# EAGLE design Nixie_PSU (EAGLE 6.1)
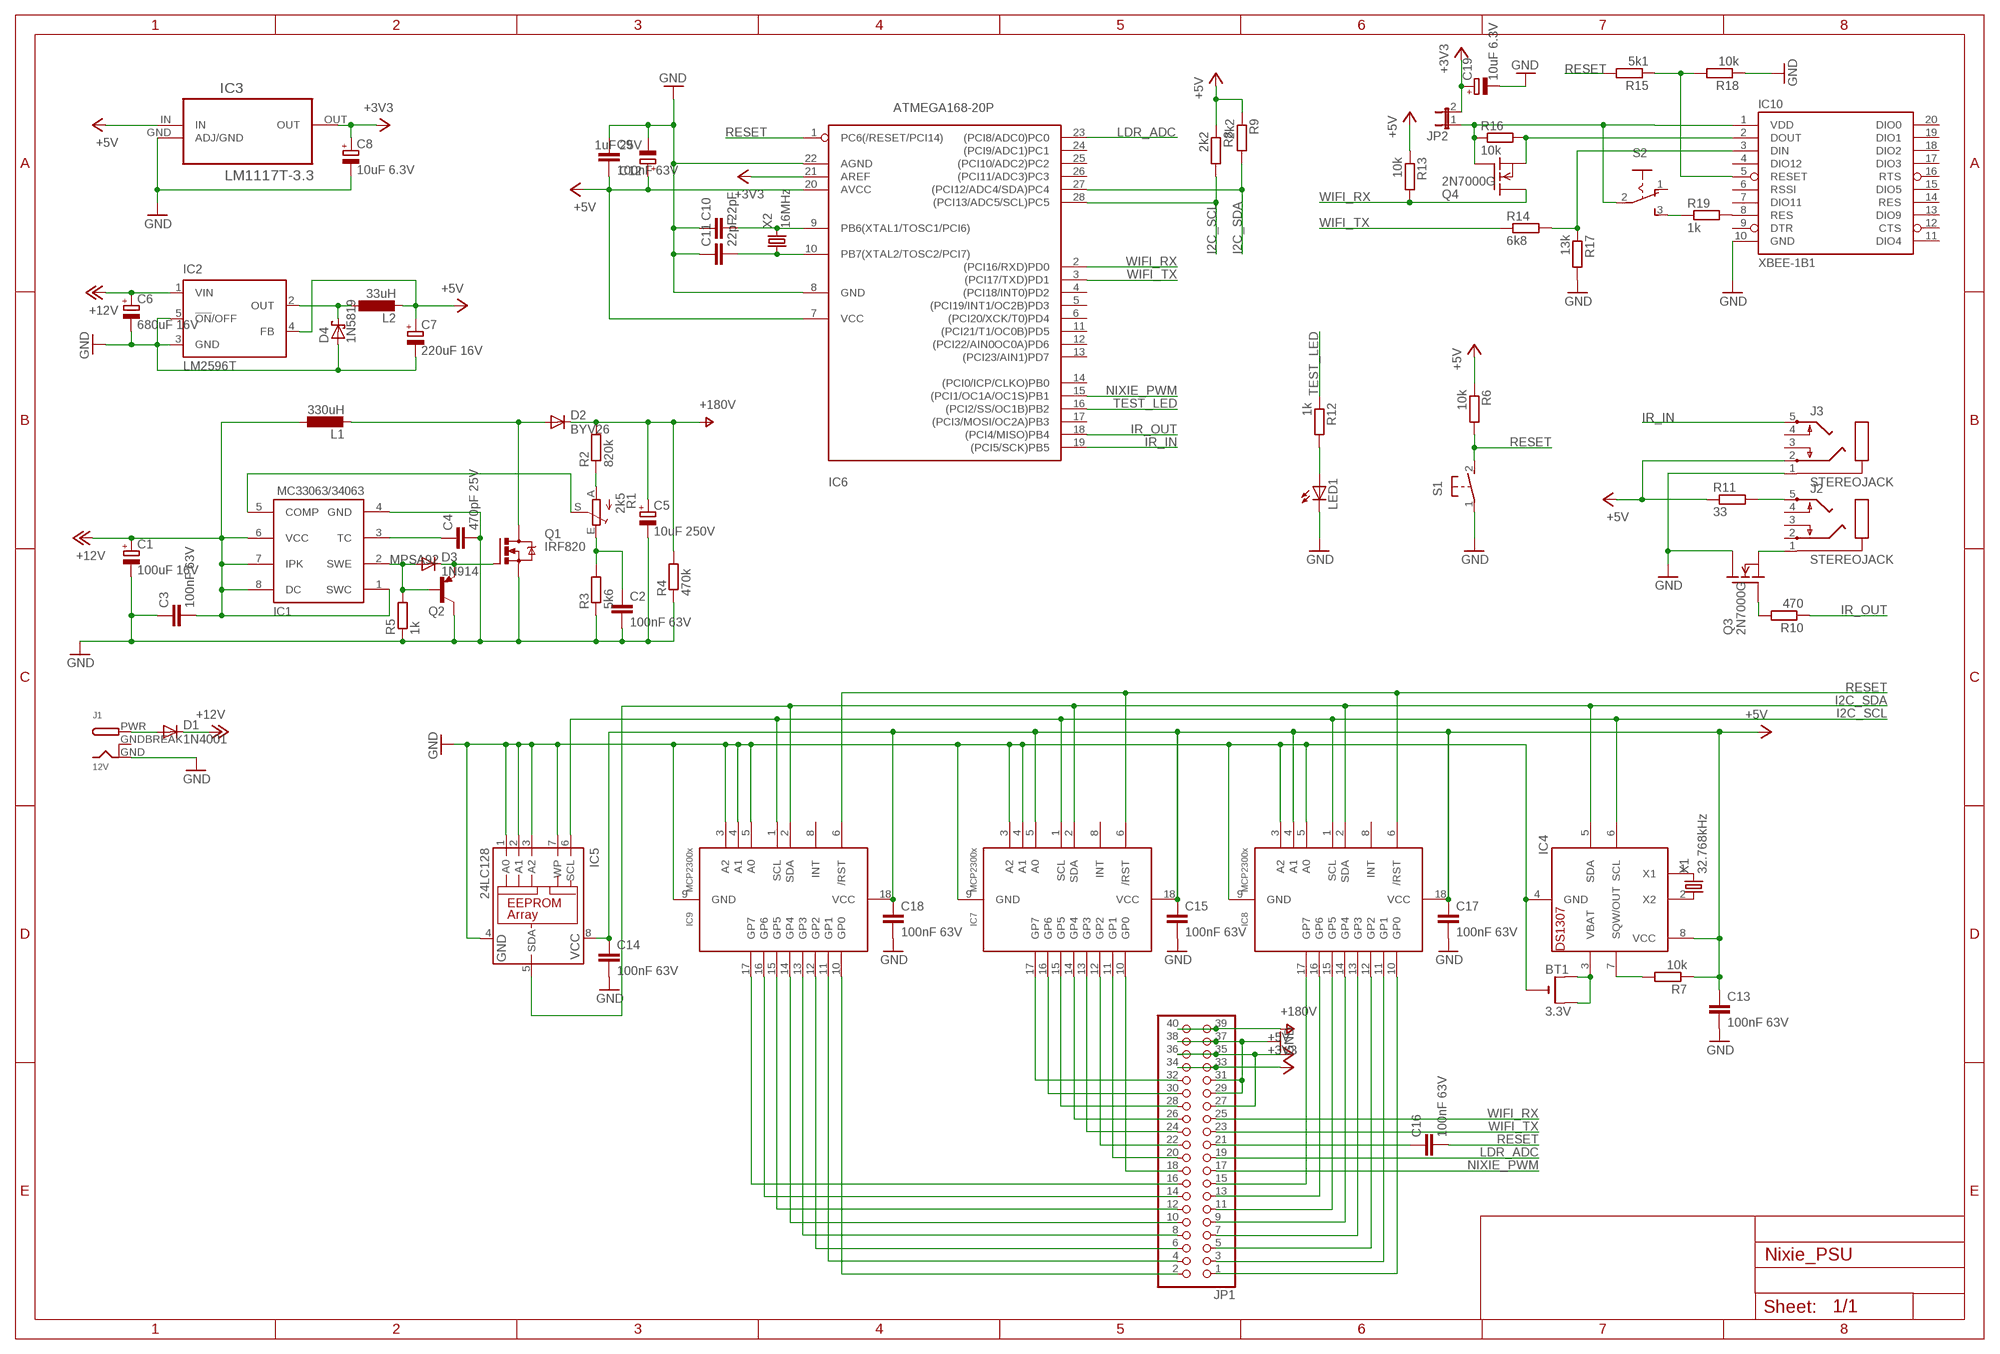
[diagram p0: schematic, sheet 1]

## Parts
BT1  3.3V  CR1220THM  [CR1220-THM]
C1  100uF 16V  CPOL-EUE2-5  [E2-5]
C2  100nF 63V  C-EU050-025X075  [C050-025X075]
C3  100nF 63V  C-EU050-025X075  [C050-025X075]
C4  470pF 25V  C-EU025-025X050  [C025-025X050]
C5  10uF 250V  CPOL-EUE5-10.5  [E5-10,5]
C6  680uF 16V  CPOL-EUE3.5-8  [E3,5-8]
C7  220uF 16V  CPOL-EUE2.5-7  [E2,5-7]
C8  10uF 6.3V  CPOL-EUE5-4  [E5-4]
C9  100nF 63V  C-EU050-025X075  [C050-025X075]
C10  22pF  C-EU025-025X050  [C025-025X050]
C11  22pF  C-EU025-025X050  [C025-025X050]
C12  1uF 25V  CPOL-EUE5-4  [E5-4]
C13  100nF 63V  C-EU050-025X075  [C050-025X075]
C14  100nF 63V  C-EU050-025X075  [C050-025X075]
C15  100nF 63V  C-EU050-025X075  [C050-025X075]
C16  100nF 63V  C-EU050-025X075  [C050-025X075]
C17  100nF 63V  C-EU050-025X075  [C050-025X075]
C18  100nF 63V  C-EU050-025X075  [C050-025X075]
C19  10uF 6.3V  CPOL-EUE5-4  [E5-4]
D1  1N4001  1N4004  [DO41-10]
D2  BYV26  BYV27  [SOD57-10]
D3  1N914  DIODE-DO34-7  [DO34-7]
D4  1N5819  SCHOTTKY-DIODEDO41  [DO41-10]
IC1  MC33063/MC34063P  [DIL08]
IC2  LM2596T  [T05D]
IC3  LM1117T-3.3  [TO220BV]
IC4  DS1307  [DIL08]
IC5  24LC128  24  [DIL08]
IC6  ATMEGA168-20P  [DIL28-3]
IC7  MCP2300X/P  [DIL18]
IC8  MCP2300X/P  [DIL18]
IC9  MCP2300X/P  [DIL18]
IC10  XBEE-1B1  [XBEE-1]
J1  12V  DCBARRELPTH  [DCJACK_2MM_PTH]
J2  STEREOJACK  [STX3100]
J3  STEREOJACK  [STX3100]
JP1  PINHD-2X20  [2X20]
JP2  JP1E  [JP1]
L1  330uH  L-EU0207/5V  [0207/5V]
L2  33uH  L-EU0207/5V  [0207/5V]
LED1  LED5MM  [LED5MM]
Q1  IRF820  IRF540  [TO220BV]
Q2  MPSA92  -PNP-TO92  [TO92]
Q3  2N7000G  TN0604N3  [TO-92]
Q4  2N7000G  TN0604N3  [TO-92]
R1  2k5  TRIM_EU-RJ9W  [RJ9W]
R2  820k  R-EU_0207/10  [0207/10]
R3  5k6  R-EU_0207/10  [0207/10]
R4  470k  R-EU_0207/10  [0207/10]
R5  1k  R-EU_0207/10  [0207/10]
R6  10k  R-EU_0207/10  [0207/10]
R7  10k  R-EU_0207/10  [0207/10]
R8  2k2  R-EU_0207/10  [0207/10]
R9  2k2  R-EU_0207/10  [0207/10]
R10  470  R-EU_0207/10  [0207/10]
R11  33  R-EU_0207/10  [0207/10]
R12  1k  R-EU_0207/10  [0207/10]
R13  10k  R-EU_0207/10  [0207/10]
R14  6k8  R-EU_0207/10  [0207/10]
R15  5k1  R-EU_0207/10  [0207/10]
R16  10k  R-EU_0207/10  [0207/10]
R17  13k  R-EU_0207/10  [0207/10]
R18  10k  R-EU_0207/10  [0207/10]
R19  1k  R-EU_0207/10  [0207/10]
S1  31-XX  [B3F-31XX]
S2  M251  [M251]
X1  32.768kHz  CRYSTALTC38H  [TC38H]
X2  16MHz  CRYSTALHC18U-V  [HC18U-V]

## Nets
+3V3: C8.+ C19.+ IC3.OUT IC6.21(AREF) JP1.33 JP1.34 JP2.2
+5V: C7.+ C9.2 C12.+ C13.1 C14.1 C15.1 C17.1 C18.1 IC2.4(FB) IC3.IN IC4.8(VCC) IC5.8(VCC) IC6.7(VCC) IC6.20(AVCC) IC7.5(A0) IC7.18(VCC) IC8.4(A1) IC8.18(VCC) IC9.18(VCC) J3.2 JP1.27 JP1.35 JP1.36 L2.2 R6.1 R7.1 R8.1 R9.1 R11.1 R13.1
+12V: C1.+ C3.2 C6.+ D1.C IC1.1(SWC) IC1.6(VCC) IC1.7(IPK) IC1.8(DC) IC2.1(VIN) L1.1
GND: BT1.- C1.- C2.2 C3.1 C4.2 C5.- C6.- C7.- C8.- C9.1 C10.1 C11.1 C12.- C13.2 C14.2 C15.2 C17.2 C18.2 C19.- D4.A IC1.4(GND) IC2.3(GND) IC2.5(!ON!/OFF) IC3.GND(ADJ/GND) IC4.4(GND) IC5.1(A0) IC5.2(A1) IC5.3(A2) IC5.4(GND) IC5.7(WP) IC6.8(GND) IC6.22(AGND) IC7.3(A2) IC7.4(A1) IC7.9(GND) IC8.3(A2) IC8.5(A0) IC8.9(GND) IC9.3(A2) IC9.4(A1) IC9.5(A0) IC9.9(GND) IC10.10(GND) J1.GND J3.1 JP1.29 JP1.31 JP1.37 JP1.38 LED1.K(C) Q1.S Q2.3(C) Q3.3(D) R3.1 R4.1 R5.1 R17.2 R18.1 S1.1(P)
I2C_SCL: IC4.6(SCL) IC5.6(SCL) IC6.28((PCI13/ADC5/SCL)PC5) IC7.1(SCL) IC8.1(SCL) IC9.1(SCL) R8.2
I2C_SDA: IC4.5(SDA) IC5.5(SDA) IC6.27((PCI12/ADC4/SDA)PC4) IC7.2(SDA) IC8.2(SDA) IC9.2(SDA) R9.2
IR_IN: IC6.19((PCI5/SCK)PB5) J3.5
IR_OUT: IC6.18((PCI4/MISO)PB4) R10.1
LDR_ADC: IC6.23((PCI8/ADC0)PC0) JP1.19
N$1: C4.1 IC1.3(TC)
N$2: D3.A IC1.2(SWE) Q2.2(B) R5.2
N$3: D2.A L1.2 Q1.D
N$4: C16.1 JP1.21
N$5: IC1.5(COMP) R1.S
N$6: Q3.2(G) R10.2
N$7: J2.1 Q3.1(S)
N$8: IC10.1(VDD) JP2.1 Q4.2(G) R16.1 S2.2(P)
N$9: C11.2 IC6.10(PB7(XTAL2/TOSC2/PCI7)) X2.1
N$10: C10.2 IC6.9(PB6(XTAL1/TOSC1/PCI6)) X2.2
N$11: IC4.1(X1) X1.2
N$12: IC4.2(X2) X1.1
N$13: BT1.+1(+) BT1.+2(+1) IC4.3(VBAT)
N$14: IC4.7(SQW/OUT) R7.2
N$15: IC9.10(GP0) JP1.2
N$16: D4.C IC2.2(OUT) L2.1
N$17: IC9.11(GP1) JP1.4
N$18: IC9.12(GP2) JP1.6
N$19: IC9.13(GP3) JP1.8
N$20: IC9.14(GP4) JP1.10
N$21: IC9.15(GP5) JP1.12
N$22: IC9.16(GP6) JP1.14
N$23: IC9.17(GP7) JP1.16
N$24: IC7.10(GP0) JP1.18
N$25: IC7.11(GP1) JP1.20
N$26: IC7.12(GP2) JP1.22
N$27: IC7.13(GP3) JP1.24
N$28: IC7.14(GP4) JP1.26
N$29: IC7.15(GP5) JP1.28
N$30: IC7.16(GP6) JP1.30
N$31: IC7.17(GP7) JP1.32
N$32: IC8.10(GP0) JP1.1
N$33: IC8.11(GP1) JP1.3
N$34: IC8.12(GP2) JP1.5
N$35: IC8.13(GP3) JP1.7
N$36: IC8.14(GP4) JP1.9
N$37: IC8.15(GP5) JP1.11
N$38: IC8.16(GP6) JP1.13
N$39: IC8.17(GP7) JP1.15
N$40: R19.1 S2.3(S)
N$41: IC10.5(RESET) R15.1 R18.2
N$42: D3.C Q1.G Q2.1(E)
N$44: LED1.A R12.2
N$47: J2.5 R11.2
N$48: IC10.8(RES) R19.2
N$49: C2.1 R1.E R3.2
N$50: R1.A R2.1
N$53: IC10.2(DOUT) Q4.1(S) R16.2
N$56: IC10.3(DIN) R14.2 R17.1
NIXIE_PWM: IC6.15((PCI1/OC1A/OC1S)PB1) JP1.17
PWR: D1.A J1.PWR
RESET: C16.2 IC6.1(PC6(/RESET/PCI14)) IC7.6(/RST) IC8.6(/RST) IC9.6(/RST) R6.2 R15.2 S1.2(S)
TEST_LED: IC6.16((PCI2/SS/OC1B)PB2) R12.1
V+: C5.+ D2.C JP1.39 JP1.40 R2.2 R4.2 ; supply symbol labelled +180V
WIFI_RX: IC6.2((PCI16/RXD)PD0) JP1.25 Q4.3(D) R13.2
WIFI_TX: IC6.3((PCI17/TXD)PD1) JP1.23 R14.1
Unconnected: IC6.4((PCI18/INT0)PD2) IC6.5((PCI19/INT1/OC2B)PD3) IC6.6((PCI20/XCK/T0)PD4) IC6.11((PCI21/T1/OC0B)PD5) IC6.12((PCI22/AIN0OC0A)PD6) IC6.13((PCI23/AIN1)PD7) IC6.14((PCI0/ICP/CLKO)PB0) IC6.17((PCI3/MOSI/OC2A)PB3) IC6.24((PCI9/ADC1)PC1) IC6.25((PCI10/ADC2)PC2) IC6.26((PCI11/ADC3)PC3) IC7.8(INT) IC8.8(INT) IC9.8(INT) IC10.4(DIO12) IC10.6(RSSI) IC10.7(DIO11) IC10.9(DTR) IC10.11(DIO4) IC10.12(CTS) IC10.13(DIO9) IC10.14(RES) IC10.15(DIO5) IC10.16(RTS) IC10.17(DIO3) IC10.18(DIO2) IC10.19(DIO1) IC10.20(DIO0) J2.2 J2.3 J2.4 J3.3 J3.4 S2.1(O)

## Power pins joined to a net without a drawn wire
GNDBREAK: J1.GNDBREAK

## Library data of the parts
BT1 = adafruit:CR1220: CR1216/CR1220/CR1225 12mm 3V lithium coin cell Great for battery packup. Both SMT and THM holders. Note the THM package has the ground pads on both sides of the PCB so that the masks are the same - this reduces the cost
C1 C5-C8 C12 C19 = resistor:CPOL-EU: POLARIZED CAPACITOR, European symbol
C2-C4 C9-C11 C13-C18 = resistor:C-EU: CAPACITOR, European symbol
D1 = adafruit:1N4004: DIODE General purpose 1N400x type rectifier (With bigger pads) http://www.ladyada.net/library/pcb/eaglelibrary.html
D2 = diode:BYV27: DIODE ultra fast
D3 = diode:DIODE-: DIODE
D4 = adafruit:SCHOTTKY-DIODE: Schottky Diode
IC1 = adafruit:MC33063/MC34063: MC33063 and MC34063 Basic DC/DC converter with internal power-NPN transistor, 100KHz, 1.5A peak switch current. 3-40 input/output.
IC2 = national-semiconductor:LM2596: SIMPLE SWITCHER® Power Converter 150 kHz 3A Step-Down Voltage Regulator Source: http://www.national.com/ds/LM/LM2596.pdf; MPN: LM2596T-ADJ/LF02; OC_FARNELL: 9494162; OC_NEWARK: 65K5910
IC3 = LM1117:LM1117T-3.3: IC, LDO VOLT REG, 3.3V, 0.8A
IC4 = adafruit:DS1307: DS1307 Real time clock (RTC) with battery backup ability. Talk to it via i2c
IC5 = microchip:24*: Serial EEPROM I2C
IC6 = adafruit:ATMEGA168*P: MICROCONTROLLER 16 kBytes FLASH 1 kBytes SRAM 512 Bytes EEPROM USART 8-channel 10 bit ADC
IC7-IC9 = adafruit:MCP2300X: MCP23008 Inexpensive i2c i/o expander - 8 general purpose i/o pins with optional pullups
IC10 = SparkFun:XBEE-1
J1 = adafruit:DCBARREL: 2.0mm DC Barrel Jack DCJACK_2MM_PTH - Through Hole Jack (4UConnector: 05537)
J2 J3 = adafruit:STEREOJACK: MIC/HEADPHONE JACK Stereo jack with two switches. Kycon STX3100, CUI SJ1-3555NG and/or 4UCon 05544
JP1 = pinhead:PINHD-2X20: PIN HEADER
JP2 = jumper:JP1E: JUMPER
L1 L2 = resistor:L-EU: INDUCTOR, European symbol
LED1 = led:LED: LED OSRAM: - CHIPLED LG R971, LG N971, LY N971, LG Q971, LY Q971, LO R971, LY R971 LH N974, LH R974 LS Q976, LO Q976, LY Q976 LO Q996 - Hyper CHIPLED LW Q18S LB Q993, LB Q99A, LB R99A - SideLED LS A670, LO A670, LY A670, LG A670, LP A670 LB A673, LV A673, LT A673, LW A673 LH A674 LY A675 LS A676, LA A676, LO A676, LY A676, LW A676 LS A679, LY A679, LG A679 - Hyper Micro SIDELED® LS Y876, LA Y876, LO Y876, LY Y876 LT Y87S - SmartLED LW L88C, LW L88S LB L89C, LB L89S, LG L890 LS L89K, LO L89K, LY L89K LS L896, LA L896, LO L896, LY L896 - TOPLED LS T670, LO T670, LY T670, LG T670, LP T670 LSG T670, LSP T670, LSY T670, LOP T670, LYG T670 LG T671, LOG T671, LSG T671 LB T673, LV T673, LT T673, LW T673 LH T674 LS T676, LA T676, LO T676, LY T676, LB T676, LH T676, LSB T676, LW T676 LB T67C, LV T67C, LT T67C, LS T67K, LO T67K, LY T67K, LW E67C LS E67B, LA E67B, LO E67B, LY E67B, LB E67C, LV E67C, LT E67C LW T67C LS T679, LY T679, LG T679 LS T770, LO T770, LY T770, LG T770, LP T770 LB T773, LV T773, LT T773, LW T773 LH T774 LS E675, LA E675, LY E675, LS T675 LS T776, LA T776, LO T776, LY T776, LB T776 LHGB T686 LT T68C, LB T68C - Hyper Mini TOPLED® LB M676 - Mini TOPLED Santana® LG M470 LS M47K, LO M47K, LY M47K Source: http://www.osram.convergy.de LUXEON: - LUMILED® LXK2-PW12-R00, LXK2-PW12-S00, LXK2-PW14-U00, LXK2-PW14-V00 LXK2-PM12-R00, LXK2-PM12-S00, LXK2-PM14-U00 LXK2-PE12-Q00, LXK2-PE12-R00, LXK2-PE12-S00, LXK2-PE14-T00, LXK2-PE14-U00 LXK2-PB12-K00, LXK2-PB12-L00, LXK2-PB12-M00, LXK2-PB14-N00, LXK2-PB14-P00, LXK2-PB14-Q00 LXK2-PR12-L00, LXK2-PR12-M00, LXK2-PR14-Q00, LXK2-PR14-R00 LXK2-PD12-Q00, LXK2-PD12-R00, LXK2-PD12-S00 LXK2-PH12-R00, LXK2-PH12-S00 LXK2-PL12-P00, LXK2-PL12-Q00, LXK2-PL12-R00 Source: www.luxeon.com KINGBRIGHT: KA-3528ASYC Source: www.kingbright.com
Q1 = transistor-power:IRF540: HEXFET Power MOSFET
Q2 = transistor:*-PNP-: PNP Transistror
Q3 Q4 = transistor-fet:TN0604N3: N-Channel Enhancement MOSFET 40V; 4A; 0,75Ohm
R1 = pot:TRIM_EU-: POTENTIOMETER
R2-R19 = resistor:R-EU_: RESISTOR, European symbol
S1 = adafruit:31-XX: OMRON SWITCH Now with beefier pads!
S2 = switch:M251: SLIDING SWITCH Mors, distributor Buerklin, 11G702
X1 X2 = crystal:CRYSTAL: CRYSTAL; OC_FARNELL: unknown; OC_NEWARK: unknown

## Board
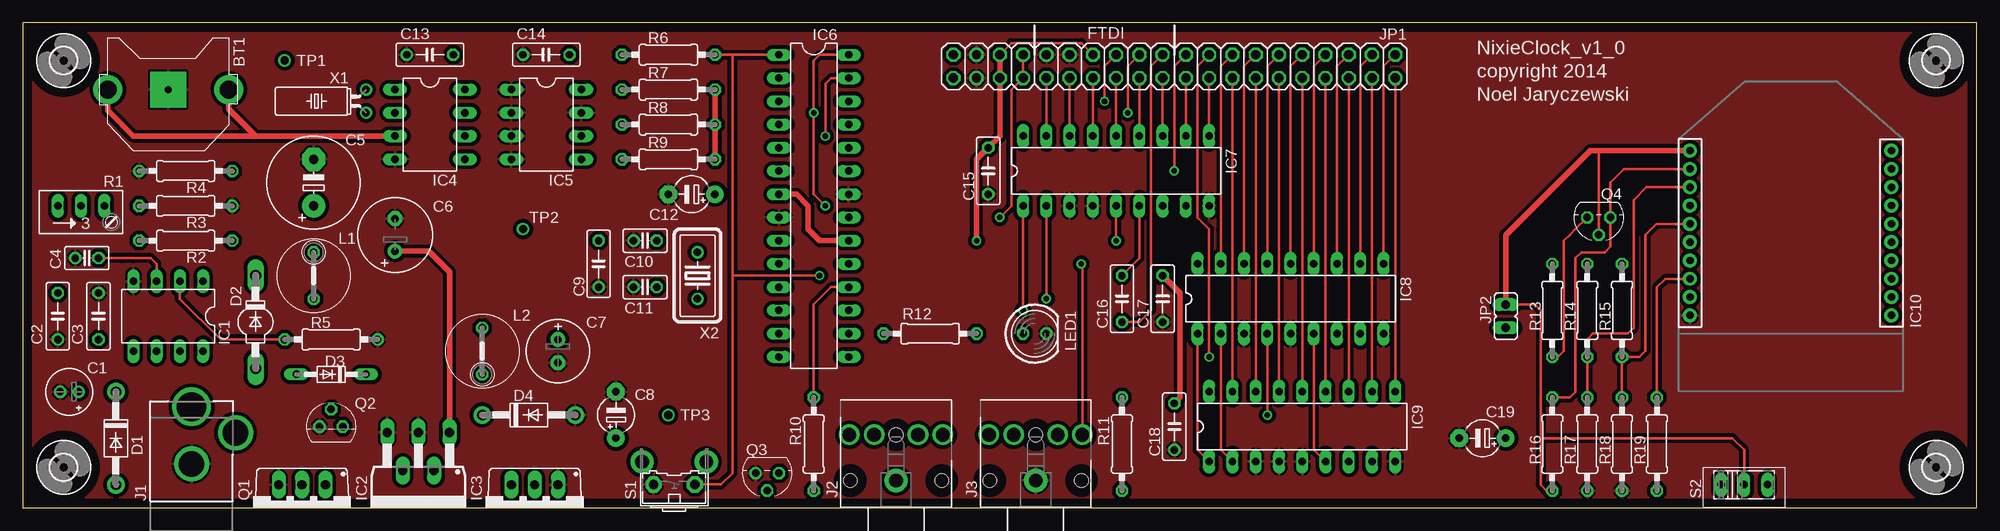
[diagram p1: board, top side]
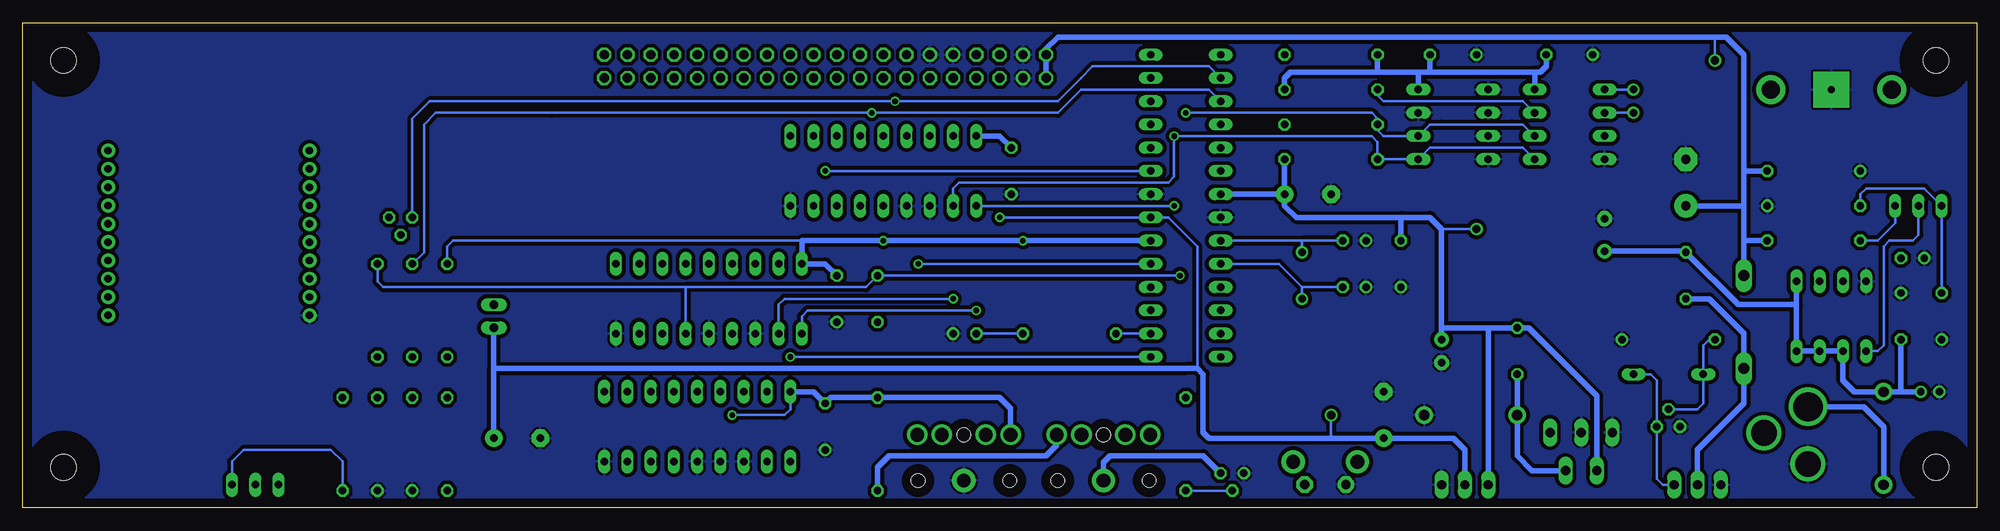
[diagram p2: board, bottom side, seen from below]

Size 213.34 x 53.01 mm. Coordinates in mm from the lower left corner, seen from the top.
Outline: 0,0 213.34,0 213.34,53.01 0,53.01 0,0
Copper layers (1*16): Top 0.035mm / dielectric 1.5mm / Bottom 0.035mm
Design rules: minimum track width 6mil, minimum drill 24mil, track to track 6mil, track to pad 8mil, pad to pad 8mil, via to via 8mil, smd to smd 8mil, copper to edge 40mil, drill to drill 8mil, minimum pad ring 10mil, minimum via ring 8mil, stop-mask expansion 4mil, vias tented up to drill 0mil, thermal gap 10mil

### Footprints (pad centres in the part's own frame; a part is rotated, then mirrored left to right if it is on the bottom)
CR1220-THM = drill 2 pad 3.175: +1 -6.604,0; +2 6.604,0 | drill 0.8 pad 3.962 square: - 0,0
E2-5 = drill 0.813 pad 1.27: + -1.016,0 | drill 0.813 pad 1.27 octagon: - 1.016,0
C050-025X075 = drill 0.813 octagon: 1 -2.54,0; 2 2.54,0
C025-025X050 = drill 0.813 octagon: 1 -1.27,0; 2 1.27,0
E5-10,5 = drill 1.016 pad 2.54: + -2.54,0 | drill 1.016 pad 2.54 octagon: - 2.54,0
E3,5-8 = drill 0.813 pad 1.6: + -1.778,0 | drill 0.813 pad 1.6 octagon: - 1.778,0
E2,5-7 = drill 0.813 pad 1.6: + -1.27,0 | drill 0.813 pad 1.6 octagon: - 1.27,0
E5-4 = drill 0.813 pad 1.905: + -2.54,0 | drill 0.813 pad 1.905 octagon: - 2.54,0
DO41-10 = drill 1.118 pad 1.93: A 5.08,0; C -5.08,0
SOD57-10 = drill 1.194 long: A 5.08,0; C -5.08,0
DO34-7 = drill 0.813 long: A 3.81,0; C -3.81,0
DIL08 = drill 0.813 long: 1 -3.81,-3.81; 2 -1.27,-3.81; 3 1.27,-3.81; 4 3.81,-3.81; 5 3.81,3.81; 6 1.27,3.81; 7 -1.27,3.81; 8 -3.81,3.81
T05D = drill 1.016 long: 1 -3.404,-5.08; 2 -1.702,-0.914; 3 0,-5.08; 4 1.702,-0.914; 5 3.404,-5.08
TO220BV = drill 1.016 long: GND -2.54,-2.54; IN 2.54,-2.54; OUT 0,-2.54
DIL28-3 = drill 0.813 long: 1 -16.51,-3.81; 2 -13.97,-3.81; 3 -11.43,-3.81; 4 -8.89,-3.81; 5 -6.35,-3.81; 6 -3.81,-3.81; 7 -1.27,-3.81; 8 1.27,-3.81; 9 3.81,-3.81; 10 6.35,-3.81; 11 8.89,-3.81; 12 11.43,-3.81; 13 13.97,-3.81; 14 16.51,-3.81; 15 16.51,3.81; 16 13.97,3.81; 17 11.43,3.81; 18 8.89,3.81; 19 6.35,3.81; 20 3.81,3.81; 21 1.27,3.81; 22 -1.27,3.81; 23 -3.81,3.81; 24 -6.35,3.81; 25 -8.89,3.81; 26 -11.43,3.81; 27 -13.97,3.81; 28 -16.51,3.81
DIL18 = drill 0.813 long: 1 -10.16,-3.81; 2 -7.62,-3.81; 3 -5.08,-3.81; 4 -2.54,-3.81; 5 0,-3.81; 6 2.54,-3.81; 7 5.08,-3.81; 8 7.62,-3.81; 9 10.16,-3.81; 10 10.16,3.81; 11 7.62,3.81; 12 5.08,3.81; 13 2.54,3.81; 14 0,3.81; 15 -2.54,3.81; 16 -5.08,3.81; 17 -7.62,3.81; 18 -10.16,3.81
XBEE-1 = drill 0.8 pad 1.524: 1 -11,20; 2 -11,18; 3 -11,16; 4 -11,14; 5 -11,12; 6 -11,10; 7 -11,8; 8 -11,6; 9 -11,4; 10 -11,2; 11 11,2; 12 11,4; 13 11,6; 14 11,8; 15 11,10; 16 11,12; 17 11,14; 18 11,16; 19 11,18; 20 11,20
DCJACK_2MM_PTH = drill 2.8: GND 0,7.35; GNDBREAK 4.8,10.75 | drill 3.2: PWR 0,13.6
STX3100 = drill 1.5 pad 2.54: 1 2.7,-0.1 | drill 1.5: 2 7.7,5; 3 7.7,2.3; 4 7.7,-2.5; 5 7.7,-5.2 | hole 1.5: 2.7,4.9; 2.7,-5.1; 7.7,-0.1
2X20 = drill 1.016 octagon: 1 -24.13,-1.27; 2 -24.13,1.27; 3 -21.59,-1.27; 4 -21.59,1.27; 5 -19.05,-1.27; 6 -19.05,1.27; 7 -16.51,-1.27; 8 -16.51,1.27; 9 -13.97,-1.27; 10 -13.97,1.27; 11 -11.43,-1.27; 12 -11.43,1.27; 13 -8.89,-1.27; 14 -8.89,1.27; 15 -6.35,-1.27; 16 -6.35,1.27; 17 -3.81,-1.27; 18 -3.81,1.27; 19 -1.27,-1.27; 20 -1.27,1.27; 21 1.27,-1.27; 22 1.27,1.27; 23 3.81,-1.27; 24 3.81,1.27; 25 6.35,-1.27; 26 6.35,1.27; 27 8.89,-1.27; 28 8.89,1.27; 29 11.43,-1.27; 30 11.43,1.27; 31 13.97,-1.27; 32 13.97,1.27; 33 16.51,-1.27; 34 16.51,1.27; 35 19.05,-1.27; 36 19.05,1.27; 37 21.59,-1.27; 38 21.59,1.27; 39 24.13,-1.27; 40 24.13,1.27
JP1 = drill 0.914 long: 1 0,-1.27; 2 0,1.27
0207/5V = drill 0.813 octagon: 1 -2.54,0; 2 2.54,0
LED5MM = drill 0.813 octagon: A -1.27,0; K 1.27,0
TO220BV' = drill 1.016 long: D 0,-2.54; G -2.54,-2.54; S 2.54,-2.54
TO92 = drill 0.813 octagon: 1 1.27,0; 2 0,1.905; 3 -1.27,0
TO-92 = drill 0.813 octagon: 1 -1.27,0; 2 0,1.905; 3 1.27,0
RJ9W = drill 0.813 long: A 2.54,0.635; E -2.54,0.635; S 0,0.635
0207/10 = drill 0.813 octagon: 1 -5.08,0; 2 5.08,0
B3F-31XX = drill 1.016 pad 1.778 octagon: 1 -2.261,-1.245; 2 2.261,-1.245 | drill 1.499 pad 2.54: 3 -3.505,1.245; 4 3.505,1.245
M251 = drill 0.813 long: 1 -2.54,0; 2 0,0; 3 2.54,0
2,8 = hole 2.8: 0,0
TC38H = drill 0.813: 1 -1.27,0; 2 1.27,0
HC18U-V = drill 0.813: 1 -2.54,0; 2 2.54,0

### Placement (x,y rotation side)
BT1  15.88,45.72 0 top
C1  5.08,12.7 180 top
C2  3.81,20.95 270 top
C3  8.26,20.95 270 top
C4  6.99,27.3 180 top
C5  31.75,35.56 90 top
C6  40.64,29.84 90 top
C7  58.42,17.14 270 top
C8  64.77,10.16 90 top
C9  62.87,26.67 90 top
C10  67.94,29.21 0 top
C11  67.94,24.13 0 top
C12  73.03,34.29 180 top
C13  44.45,49.53 180 top
C14  57.15,49.53 180 top
C15  105.41,36.83 270 top
C16  120.02,22.86 90 top
C17  124.46,22.86 270 top
C18  125.73,8.89 270 top
C19  159.38,7.62 180 top
D1  10.16,7.62 270 top
D2  25.4,20.32 270 top
D3  33.66,14.61 180 top
D4  55.24,10.16 0 top
IC1  15.88,20.95 180 top
IC2  43.18,3.17 180 top
IC3  55.88,0 180 top
IC4  44.45,41.91 270 top
IC5  57.15,41.91 270 top
IC6  86.36,33.02 270 top
IC7  119.38,36.83 0 top
IC8  138.43,22.86 0 top
IC9  139.7,8.89 0 top
IC10  193.04,19.05 0 top
J1  18.41,-2.54 0 top
J2  95.25,0.3 90 top
J3  110.49,0.3 90 top
JP1  125.73,48.26 180 top
JP2  161.93,20.95 180 top
L1  31.75,25.4 270 top
L2  50.16,17.14 90 top
LED1  110.49,19.05 0 top
Q1  IRF820  [TO220BV']  30.48,0 180 top
Q2  33.66,8.89 0 top
Q3  81.28,3.81 180 top
Q4  172.09,31.75 180 top
R1  6.35,32.38 0 top
R2  17.78,29.21 0 top
R3  17.78,33.02 180 top
R4  17.78,36.83 0 top
R5  33.66,18.41 180 top
R6  70.48,49.53 0 top
R7  70.48,45.72 180 top
R8  70.48,41.91 180 top
R9  70.48,38.1 180 top
R10  86.36,6.99 270 top
R11  120.02,6.99 270 top
R12  99.06,19.05 0 top
R13  167,21.59 270 top
R14  170.81,21.59 270 top
R15  174.62,21.59 90 top
R16  167,6.99 90 top
R17  170.81,6.99 270 top
R18  174.62,6.99 90 top
R19  178.44,6.99 90 top
S1  71.12,3.81 0 top
S2  187.96,2.54 0 top
U$1  [2,8]  4.45,4.45 0 top
U$3  [2,8]  4.45,48.9 0 top
U$4  [2,8]  208.91,48.9 0 top
U$5  [2,8]  208.91,4.45 0 top
X1  37.47,44.45 90 top
X2  73.66,25.4 90 top

### Tracks (layer width: path | path; a pad name or v marks a point on that pad's centre or on a via)
+3V3  (via drill 0.61, 0.9)
  Top 0.254: v106.68,31.75 107.95,33.02 107.95,45.72 JP1.34 JP1.33
  Bottom 0.254: 85.09,15.24 85.09,28.57 88.27,31.75 IC6.21 v106.68,31.75 | v70.48,10.16 70.48,7.62
  Bottom 0.61: IC3.OUT 55.88,6.35 57.15,7.62 C8.+ 70.48,7.62 83.82,7.62 84.45,8.26 84.45,14.61 85.09,15.24 86.36,15.24 161.93,15.24 | JP2.2 161.93,15.24 | C19.+ 161.93,15.24
+5V  (via drill 0.61, 0.9)
  Top 0.254: IC7.5 v119.38,29.21 | v135.89,10.16 IC8.4 | JP1.35 107.95,50.8 115.57,50.8 JP1.27
  Top 0.61: R7.1 R8.1 R9.1 | v104.14,29.21 104.14,38.1 C15.1 106.68,40.64 JP1.36 JP1.35 | IC6.7 84.45,34.29 85.72,33.02 85.72,30.48 87,29.21 IC6.20 | C17.1 126.36,23.5 126.36,12.06 C18.1
  Bottom 0.254: IC9.18 129.54,10.79 130.18,10.16 135.25,10.16 v135.89,10.16 | R13.1 167,28.57 166.37,29.21 128.27,29.21 | v54.61,30.48 58.42,30.48
  Bottom 0.61: 62.87,31.75 C9.2 | R6.1 65.41,48.26 | 65.41,48.26 65.41,47.62 | 65.41,47.62 74.93,47.62 75.56,46.99 R7.1 | IC6.20 v104.14,29.21 v119.38,29.21 128.27,29.21 IC8.18 125.73,26.67 C17.1 | IC9.18 127,12.7 C18.1 125.09,12.06 R11.1 106.68,12.06 105.49,10.88 J3.2 | IC7.18 106.68,40.64 C15.1 | 62.87,31.75 59.69,31.75 58.42,30.48 | C12.+ 75.56,33.02 74.3,31.75 62.87,31.75 | C12.+ IC6.7 | R9.1 75.56,36.83 75.56,35.56 C12.+ | 65.41,48.26 65.41,47.62 | 65.41,47.62 60.96,47.62 | 60.96,47.62 59.69,47.62 | 59.69,47.62 48.26,47.62 | C14.1 59.69,47.62 | IC5.8 60.96,47.62 | IC4.8 48.26,46.99 48.26,47.62 | C13.1 46.99,48.26 47.62,47.62 48.26,47.62 | IC2.4 41.48,12.27 47.62,18.41 48.9,19.68 L2.2 52.07,19.68 53.34,19.68 | 58.42,30.48 58.42,19.68 | 58.42,19.68 C7.+ 58.42,19.68 | 58.42,19.68 58.42,30.48 | 53.34,19.68 58.42,19.68 | IC3.IN 53.34,19.68
+12V
  Top 0.61: IC2.1 46.58,25.81 44.45,27.94 44.32,28.07 C6.+
  Bottom 0.61: C1.+ 6.35,12.7 | 6.35,12.7 6.99,12.7 | 6.99,12.7 8.26,12.7 | 8.26,12.7 8.89,12.7 D1.C 13.34,12.7 14.61,13.97 IC1.6 IC1.7 | IC1.8 IC1.7 | IC1.8 19.68,22.23 | 19.68,22.23 IC1.1 | C3.2 8.26,12.7 | 8.26,12.7 6.99,12.7 | 6.99,12.7 6.35,12.7 | 19.68,22.23 26.04,22.23 L1.1 31.88,28.07 C6.+ | IC1.8 IC1.7
GND
  pour Bottom (isolate 0.406): -1.27,54.61 214.63,54.61 214.63,-1.27 -1.27,-1.27
  pour Top (isolate 0.406): -1.27,54.61 214.63,54.61 214.63,-1.27 -1.27,-1.27
I2C_SCL  (via drill 0.61)
  Top 0.254: IC6.28 87,49.53 86.36,48.9 v86.36,43.18 86.36,34.29 v87.63,33.02 | IC8.1 128.27,6.35 IC9.1 | IC7.1 v109.22,21.59
  Bottom 0.254: IC4.6 49.53,41.91 50.8,41.91 58.42,41.91 59.69,41.91 IC5.6 64.77,40.64 65.41,41.27 R8.2 65.41,42.55 66.04,43.18 v86.36,43.18 | v109.22,21.59 127.64,21.59 128.27,20.95 IC8.1 | v87.63,33.02 IC7.1
I2C_SDA  (via drill 0.61)
  Top 0.254: IC6.27 88.27,46.99 87.63,46.35 v87.63,40.64 | IC8.2 130.81,6.35 IC9.2 | IC7.2 v111.76,22.86
  Bottom 0.254: IC4.5 49.53,39.37 50.8,39.37 58.42,39.37 59.69,39.37 IC5.5 R9.2 65.41,40.01 66.04,40.64 66.67,40.64 v87.63,40.64 87.63,36.2 88.27,35.56 111.12,35.56 111.76,34.92 IC7.2 | v111.76,22.86 130.18,22.86 130.81,22.23 IC8.2
IR_IN  (via drill 0.61)
  Top 0.254: J3.5 115.69,26.55 v115.57,26.67
  Bottom 0.254: v115.57,26.67 IC6.19
IR_OUT
  Top 0.254: IC6.18 88.27,24.13 86.36,22.23 86.36,21.59 R10.1
LDR_ADC  (via drill 0.61)
  Top 0.254: v125.73,36.83 125.73,41.91 125.73,48.26 JP1.19
  Bottom 0.254: IC6.23 v125.73,36.83
N$1
  Top 0.254: IC1.3 14.61,26.67 13.97,27.3 12.06,27.3 10.79,27.3 C4.1
N$2
  Top 0.254: R5.2 21.59,18.41 17.14,22.86 IC1.2
  Bottom 0.254: R5.2 29.21,18.41 29.84,17.78 D3.A 29.84,11.43 30.48,10.79 Q2.2
N$3
  Bottom 0.61: L1.2 29.21,22.86 25.4,19.05 D2.A 25.4,11.43 30.48,6.35 Q1.D
N$4
  Top 0.254: JP1.21 123.19,48.26 123.19,21.59 121.92,20.32 C16.1
N$5
  Bottom 0.254: IC1.5 10.79,17.14 10.16,17.78 10.16,28.57 9.53,29.21 6.99,29.21 6.35,29.84 R1.S
N$6
  Bottom 0.254: R10.2 83.82,1.91 Q3.2
N$7
  Bottom 0.61: J2.1 95.35,4.98 94.61,5.71 84.45,5.71 Q3.1
N$8
  Top 0.254: Q4.2 172.09,39.05 | JP2.1 165.1,22.23 165.74,21.59 165.74,7.62 | 165.74,7.62 165.74,2.54 166.37,1.91 R16.1 | S2.2 187.96,6.35 186.69,7.62 165.74,7.62
  Top 0.61: IC10.1 172.09,39.05 171.13,39.05 161.93,29.84 JP2.1
N$9
  Bottom 0.254: IC6.10 76.2,26.67 73.66,24.13 | 73.66,24.13 X2.1 | C11.2 73.66,24.13
N$10
  Bottom 0.254: IC6.9 73.66,29.21 | 73.66,29.21 X2.2 | C10.2 73.66,29.21
N$11
  Bottom 0.254: X1.2 IC4.1
N$12
  Bottom 0.254: IC4.2 X1.1
N$13
  Top 0.61: BT1.+1 9.27,43.43 9.53,43.18 12.06,40.64 25.4,40.64 | 25.4,40.64 IC4.3 | BT1.+2 22.48,43.56 25.4,40.64
N$14
  Bottom 0.254: IC4.7 49.53,44.45 64.77,44.45 65.41,45.09 R7.2
N$15
  Top 0.254: IC9.10 JP1.2
N$16
  Bottom 0.61: L2.1 D4.C 50.16,5.71 48.54,4.09 IC2.2
N$17
  Top 0.254: IC9.11 JP1.4
N$18
  Top 0.254: IC9.12 JP1.6
N$19
  Top 0.254: IC9.13 JP1.8
N$20
  Top 0.254: IC9.14 JP1.10
N$21
  Top 0.254: IC9.15 JP1.12
N$22
  Top 0.254: IC9.16 JP1.14
N$23
  Top 0.254: IC9.17 JP1.16
N$24
  Top 0.254: IC7.10 JP1.18
N$25
  Top 0.254: IC7.11 JP1.20
N$26
  Top 0.254: JP1.22 IC7.12
N$27
  Top 0.254: IC7.13 JP1.24
N$28
  Top 0.254: JP1.26 IC7.14
N$29
  Top 0.254: IC7.15 JP1.28
N$30
  Top 0.254: IC7.16 JP1.30
N$31
  Top 0.254: JP1.32 IC7.17
N$32
  Top 0.254: IC8.10 148.59,48.26 JP1.1
N$33
  Top 0.254: JP1.3 146.05,48.26 IC8.11
N$34
  Top 0.254: IC8.12 143.51,48.26 JP1.5
N$35
  Top 0.254: JP1.7 140.97,48.26 IC8.13
N$36
  Top 0.254: IC8.14 138.43,48.26 JP1.9
N$37
  Top 0.254: JP1.11 135.89,48.26 IC8.15
N$38
  Top 0.254: IC8.16 133.35,48.26 JP1.13
N$39
  Top 0.254: JP1.15 130.81,48.26 IC8.17
N$40
  Bottom 0.254: R19.1 178.44,5.08 179.71,6.35 189.23,6.35 190.5,5.08 S2.3
N$41
  Top 0.254: R18.2 R15.1 176.53,16.51 177.16,17.14 177.16,29.84 178.37,31.05 IC10.5
N$42
  Bottom 0.254: D3.C 35.56,14.61 34.92,13.97 Q2.1 34.92,3.17 34.29,2.54 Q1.G
N$44
  Bottom 0.254: R12.2 LED1.A
N$47
  Bottom 0.61: J2.5 100.45,6.87 101.6,5.71 118.75,5.71 120.02,4.45 R11.2
N$48
  Top 0.254: IC10.8 179.35,25.05 178.44,24.13 R19.2
N$49
  Bottom 0.254: R3.2 12.7,34.29 12.06,34.92 5.71,34.92 R1.E 3.81,24.13 C2.1
N$50
  Bottom 0.254: R1.A 8.89,31.11 10.79,29.21 R2.1
N$53
  Top 0.254: R16.2 168.91,12.06 169.54,12.7 169.54,27.3 170.18,27.94 172.72,27.94 173.35,28.57 Q4.1 173.35,33.02 173.35,35.56 174.84,37.05 IC10.2
N$56
  Top 0.254: R17.1 R14.2 170.81,17.14 170.81,18.41 171.45,19.05 175.26,19.05 175.9,19.68 175.9,33.66 177.29,35.05 IC10.3
NIXIE_PWM  (via drill 0.61)
  Top 0.254: v129.54,16.51 129.54,30.48 128.27,31.75 128.27,48.26 JP1.17
  Bottom 0.254: IC6.15 v129.54,16.51
PWR
  Bottom 0.61: J1.PWR 12.33,11.06 10.16,8.89 D1.A
RESET  (via drill 0.61)
  Top 0.254: R6.2 77.47,49.53 | 77.47,49.53 IC6.1 | S1.2 76.22,2.56 77.47,3.81 77.47,25.4 | 77.47,25.4 77.47,49.53 | IC9.6 140.97,6.35 IC8.6 | v87,25.4 77.47,25.4 | C16.2 121.92,27.3 IC7.6
  Bottom 0.254: 140.97,24.13 121.28,24.13 C16.2 118.11,25.4 91.44,25.4 v87,25.4 | 140.97,24.13 140.97,23.5 IC8.6 | R15.2 174.62,24.77 173.99,24.13 140.97,24.13
TEST_LED
  Bottom 0.254: IC6.16 R12.1
V+  (via drill 0.9)
  Bottom 0.254: v28.57,48.9 28.57,51.44
  Bottom 0.61: JP1.39 JP1.40 101.6,50.16 100.33,51.44 28.57,51.44 27.3,51.44 | 27.3,51.44 25.4,49.53 | 27.3,51.44 25.4,49.53 | 25.4,49.53 25.4,36.83 | 25.4,36.83 25.4,33.02 | 25.4,33.02 25.4,29.21 | 25.4,29.21 D2.C | C5.+ 25.4,33.02 | R4.2 25.4,36.83 | R2.2 25.4,29.21
WIFI_RX  (via drill 0.61)
  Top 0.254: R13.2 167.64,16.51 168.28,17.14 168.28,27.3 168.28,29.21 168.91,29.84 169.54,30.48 Q4.3 | JP1.25 118.11,48.26 v118.11,44.45
  Bottom 0.254: IC6.2 83.82,48.26 96.52,48.26 97.79,46.99 100.33,44.45 v118.11,44.45 154.94,44.45 168.91,44.45 170.81,42.55 Q4.3
WIFI_TX  (via drill 0.61)
  Top 0.254: JP1.23 120.65,48.26 v120.65,43.18
  Bottom 0.254: IC6.3 83.82,45.72 96.52,45.72 97.79,45.72 100.33,43.18 v120.65,43.18 155.57,43.18 168.28,43.18 169.54,41.91 169.54,33.66 169.54,32.38 169.54,31.11 169.54,27.94 R14.1

### Text on the board
tNames: FTDI | NixieClock_v1_0 | TP1 | copyright 2014 | Noel Jaryczewski | TP2 | TP3